# Altium schematic sheet PB_Conn.SchDoc
size A3; SheetNumber: 11; SheetTotal: 12
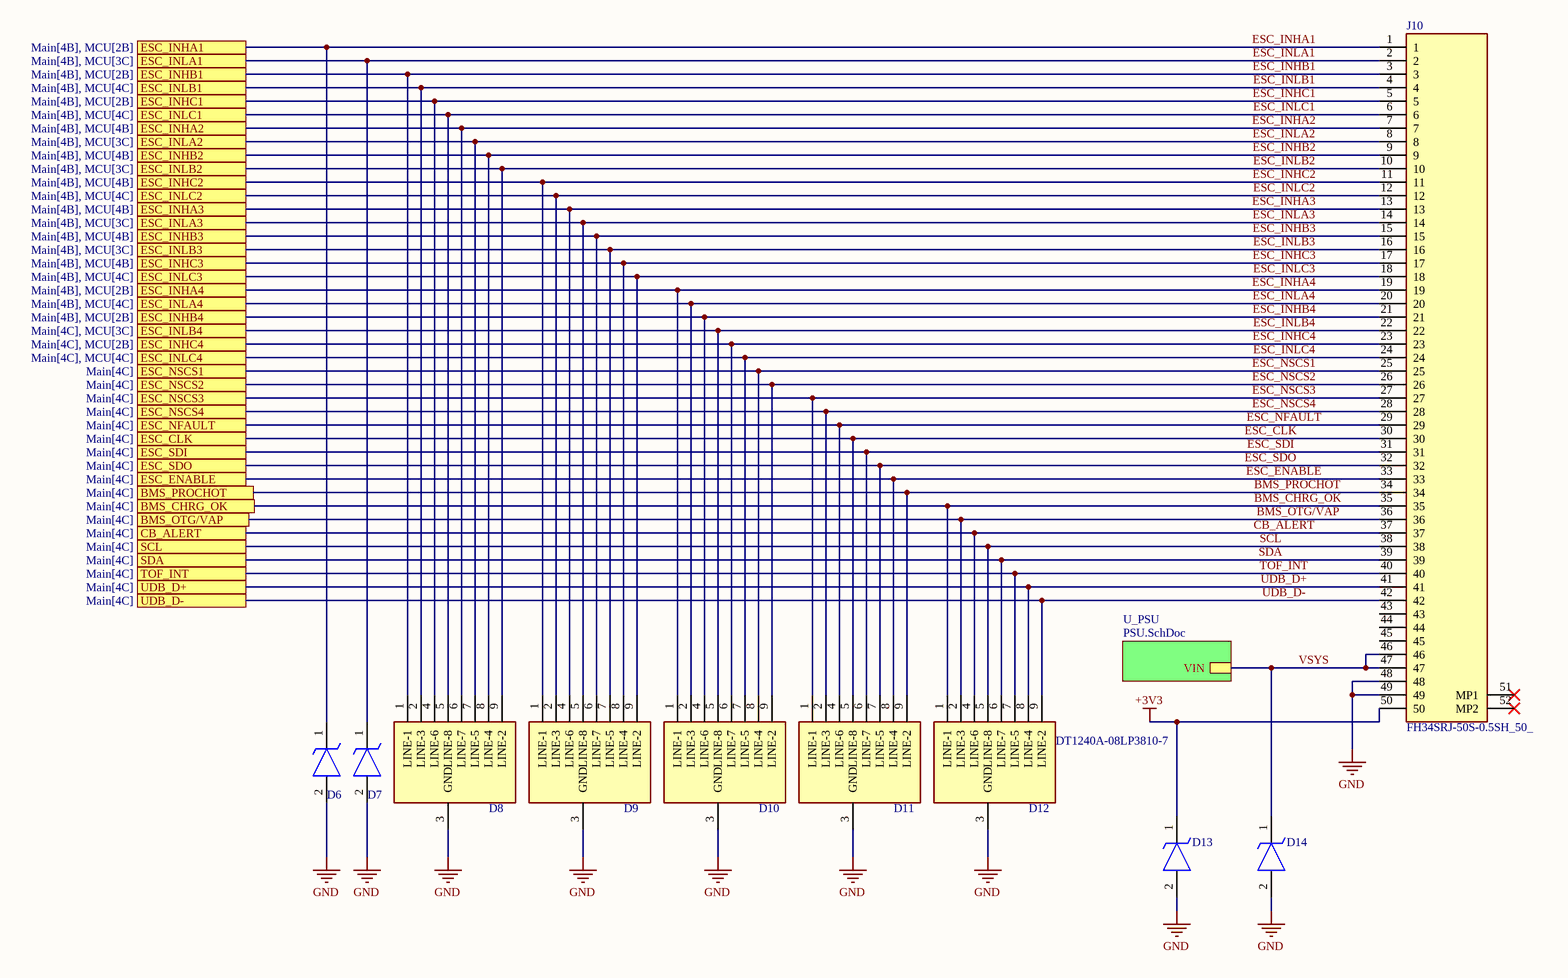
[diagram p0: PB_Conn.SchDoc]

## Parts
D6  D1213A-01LP4-7B  [D1213A01LP47B]  (value not drawn)
D7  D1213A-01LP4-7B  [D1213A01LP47B]  (value not drawn)
D8  DT1240A-08LP3810-7  [DT1240A08LP38107]  (value not drawn)
D9  DT1240A-08LP3810-7  [DT1240A08LP38107]  (value not drawn)
D10  DT1240A-08LP3810-7  [DT1240A08LP38107]  (value not drawn)
D11  DT1240A-08LP3810-7  [DT1240A08LP38107]  (value not drawn)
D12  DT1240A-08LP3810-7  [DT1240A08LP38107]
D13  DF2S24FS,L3M  [SODFL1006X45N]  (value not drawn)
D14  DF2S24FS,L3M  [SODFL1006X45N]  (value not drawn)
J10  FH34SRJ-50S-0.5SH_50_  [FH34SRJ50S05SH50]

## Sub-sheets
U_PSU = PSU.SchDoc: VIN

## Ports
BMS_CHRG_OK (see Main[4C]), BMS_OTG/VAP (see Main[4C]), BMS_PROCHOT (see Main[4C]), CB_ALERT (see Main[4C]), ESC_CLK (see Main[4C]), ESC_ENABLE (see Main[4C]), ESC_INHA1 (see Main[4B], MCU[2B]), ESC_INHA2 (see Main[4B], MCU[4B]), ESC_INHA3 (see Main[4B], MCU[4B]), ESC_INHA4 (see Main[4B], MCU[2B]), ESC_INHB1 (see Main[4B], MCU[2B]), ESC_INHB2 (see Main[4B], MCU[4B]), ESC_INHB3 (see Main[4B], MCU[4B]), ESC_INHB4 (see Main[4B], MCU[2B]), ESC_INHC1 (see Main[4B], MCU[2B]), ESC_INHC2 (see Main[4B], MCU[4B]), ESC_INHC3 (see Main[4B], MCU[4B]), ESC_INHC4 (see Main[4C], MCU[2B]), ESC_INLA1 (see Main[4B], MCU[3C]), ESC_INLA2 (see Main[4B], MCU[3C]), ESC_INLA3 (see Main[4B], MCU[3C]), ESC_INLA4 (see Main[4B], MCU[4C]), ESC_INLB1 (see Main[4B], MCU[4C]), ESC_INLB2 (see Main[4B], MCU[3C]), ESC_INLB3 (see Main[4B], MCU[3C]), ESC_INLB4 (see Main[4C], MCU[3C]), ESC_INLC1 (see Main[4B], MCU[4C]), ESC_INLC2 (see Main[4B], MCU[4C]), ESC_INLC3 (see Main[4B], MCU[4C]), ESC_INLC4 (see Main[4C], MCU[4C]), ESC_NFAULT (see Main[4C]), ESC_NSCS1 (see Main[4C]), ESC_NSCS2 (see Main[4C]), ESC_NSCS3 (see Main[4C]), ESC_NSCS4 (see Main[4C]), ESC_SDI (see Main[4C]), ESC_SDO (see Main[4C]), SCL (see Main[4C]), SDA (see Main[4C]), TOF_INT (see Main[4C]), UDB_D+ (see Main[4C]), UDB_D- (see Main[4C])

## Nets
+3V3: D13.1(K) J10.50
GND: D6.2(A) D7.2(A) D8.3(GND) D9.3(GND) D10.3(GND) D11.3(GND) D12.3(GND) D13.2(A) D14.2(A) J10.48 J10.49
BMS_CHRG_OK: D12.1(LINE-1) J10.35 ; port BMS_CHRG_OK
BMS_OTG/VAP: D12.2(LINE-3) J10.36 ; port BMS_OTG/VAP
BMS_PROCHOT: D11.9(LINE-2) J10.34 ; port BMS_PROCHOT
CB_ALERT: D12.4(LINE-6) J10.37 ; port CB_ALERT
ESC_CLK: D11.5(LINE-8) J10.30 ; port ESC_CLK
ESC_ENABLE: D11.8(LINE-4) J10.33 ; port ESC_ENABLE
ESC_INHA1: D6.1(K) J10.1 ; port ESC_INHA1
ESC_INHA2: D8.6(LINE-7) J10.7 ; port ESC_INHA2
ESC_INHA3: D9.4(LINE-6) J10.13 ; port ESC_INHA3
ESC_INHA4: D10.1(LINE-1) J10.19 ; port ESC_INHA4
ESC_INHB1: D8.1(LINE-1) J10.3 ; port ESC_INHB1
ESC_INHB2: D8.8(LINE-4) J10.9 ; port ESC_INHB2
ESC_INHB3: D9.6(LINE-7) J10.15 ; port ESC_INHB3
ESC_INHB4: D10.4(LINE-6) J10.21 ; port ESC_INHB4
ESC_INHC1: D8.4(LINE-6) J10.5 ; port ESC_INHC1
ESC_INHC2: D9.1(LINE-1) J10.11 ; port ESC_INHC2
ESC_INHC3: D9.8(LINE-4) J10.17 ; port ESC_INHC3
ESC_INHC4: D10.6(LINE-7) J10.23 ; port ESC_INHC4
ESC_INLA1: D7.1(K) J10.2 ; port ESC_INLA1
ESC_INLA2: D8.7(LINE-5) J10.8 ; port ESC_INLA2
ESC_INLA3: D9.5(LINE-8) J10.14 ; port ESC_INLA3
ESC_INLA4: D10.2(LINE-3) J10.20 ; port ESC_INLA4
ESC_INLB1: D8.2(LINE-3) J10.4 ; port ESC_INLB1
ESC_INLB2: D8.9(LINE-2) J10.10 ; port ESC_INLB2
ESC_INLB3: D9.7(LINE-5) J10.16 ; port ESC_INLB3
ESC_INLB4: D10.5(LINE-8) J10.22 ; port ESC_INLB4
ESC_INLC1: D8.5(LINE-8) J10.6 ; port ESC_INLC1
ESC_INLC2: D9.2(LINE-3) J10.12 ; port ESC_INLC2
ESC_INLC3: D9.9(LINE-2) J10.18 ; port ESC_INLC3
ESC_INLC4: D10.7(LINE-5) J10.24 ; port ESC_INLC4
ESC_NFAULT: D11.4(LINE-6) J10.29 ; port ESC_NFAULT
ESC_NSCS1: D10.8(LINE-4) J10.25 ; port ESC_NSCS1
ESC_NSCS2: D10.9(LINE-2) J10.26 ; port ESC_NSCS2
ESC_NSCS3: D11.1(LINE-1) J10.27 ; port ESC_NSCS3
ESC_NSCS4: D11.2(LINE-3) J10.28 ; port ESC_NSCS4
ESC_SDI: D11.6(LINE-7) J10.31 ; port ESC_SDI
ESC_SDO: D11.7(LINE-5) J10.32 ; port ESC_SDO
SCL: D12.5(LINE-8) J10.38 ; port SCL
SDA: D12.6(LINE-7) J10.39 ; port SDA
TOF_INT: D12.7(LINE-5) J10.40 ; port TOF_INT
UDB_D+: D12.8(LINE-4) J10.41 ; port UDB_D+
UDB_D-: D12.9(LINE-2) J10.42 ; port UDB_D-
VSYS: D14.1(K) J10.46 J10.47 ; sheet U_PSU/VIN

Not connected (* = marked no-connect by the designer): J10 43 44 45 51(MP1)* 52(MP2)*

## Library data of the parts
D6 D7 = D1213A-01LP4-7B: TVS Diode (Uni-directional); Manufacturer_Name: Diodes Incorporated; Datasheet Link: https://www.diodes.com/assets/Datasheets/D1213A-01LP4.pdf; Height: 0.4mm; Manufacturer_Part_Number: D1213A-01LP4-7B; Mouser Part Number: 621-D1213A-01LP4-7B; Mouser Price/Stock: https://www.mouser.co.uk/ProductDetail/Diodes-Incorporated/D1213A-01LP4-7B?qs=gfe7vQ8txpVKfG5NOSOvfA%3D%3D; Arrow Part Number: D1213A-01LP4-7B; Arrow Price/Stock: https://www.arrow.com/en/products/d1213a-01lp4-7b/diodes-incorporated?region=europe
D8-D12 = DT1240A-08LP3810-7: TVS Diode (Uni-directional); Manufacturer_Name: Diodes Incorporated; Datasheet Link: https://www.diodes.com//assets/Datasheets/DT1240A-08LP3810.pdf; Height: 0.55mm; Manufacturer_Part_Number: DT1240A-08LP3810-7; Mouser Part Number: 621-DT1240A08LP38107; Mouser Price/Stock: https://www.mouser.co.uk/ProductDetail/Diodes-Incorporated/DT1240A-08LP3810-7?qs=W0yvOO0ixfFwCalJyqXN4A%3D%3D; Arrow Part Number: DT1240A-08LP3810-7; Arrow Price/Stock: null?region=nac
D13 D14 = DF2S24FS,L3M: TVS Diode (Uni-directional); Manufacturer_Name: Toshiba; Datasheet Link: https://www.mouser.com/datasheet/2/408/DF2S24FS_datasheet_en_20140718-708374.pdf; Height: 0.45mm; Manufacturer_Part_Number: DF2S24FS,L3M; Mouser Part Number: 757-DF2S24FSL3M; Mouser Price/Stock: https://www.mouser.co.uk/ProductDetail/Toshiba/DF2S24FSL3M?qs=lhkzy8lC%252BSvG2umxl0FuEw%3D%3D; Arrow Part Number: DF2S24FS,L3M; Arrow Price/Stock: https://www.arrow.com/en/products/df2s24fsl3m/toshiba?region=nac
J10 = FH34SRJ-50S-0.5SH_50_: Connector; Manufacturer_Name: Hirose; Manufacturer_Part_Number: FH34SRJ-50S-0.5SH(50); Datasheet Link: https://www.hirose.com/en/product/document?clcode=CL0580-1266-2-50&productname=FH34SRJ-50S-0.5SH(50)&series=FH34SRJ&documenttype=2DDrawing&lang=en&documentid=0001483059; Height: 1.75mm; Mouser Part Number: 798-FH34SRJ50S05SH50; Mouser Price/Stock: https://www.mouser.co.uk/ProductDetail/Hirose-Connector/FH34SRJ-50S-0.5SH50?qs=vcbW%252B4%252BSTIrLLD%2F8H%2F%252B%2Fhg%3D%3D; System: Connector